# Altium schematic sheet MAGI'sUSBMeter.SchDoc
size A4
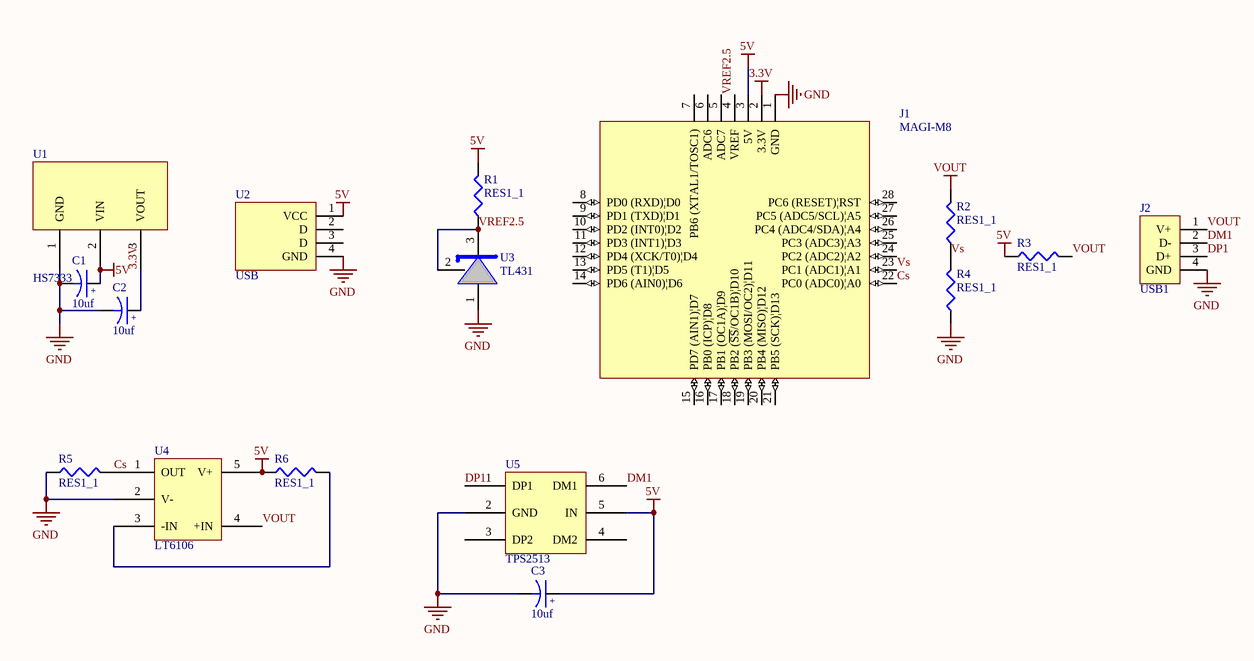
[diagram p0: MAGI'sUSBMeter.SchDoc]

## Parts
C1  10uf  [6-0805_N]
C2  10uf  [6-0805_N]
C3  10uf  [6-0805_N]
J1  MAGI-M8  [MAGI-M8]
J2  USB1  [USB-04A]
R1  RES1_1  [6-0805_N]
R2  RES1_1  [6-0805_N]
R3  RES1_1  [2512]
R4  RES1_1  [6-0805_N]
R5  RES1_1  [6-0805_N]
R6  RES1_1  [6-0805_N]
U1  HS7333  [HS7333]
U2  USB  [MicroUSB]
U3  TL431  [SOT23_N]
U4  LT6106  [LM2731]
U5  TPS2513  [TPS2513]

## Nets
3.3V: C2.1 J1.2(3.3V) U1.3(VOUT)
5V: C1.1 C3.1 J1.3(5V) R1.2 R3.1 R6.1 U1.2(VIN) U2.1(VCC) U4.5(V+) U5.5(IN)
GND: C1.2 C2.2 C3.2 J1.1(GND) J2.4(GND) R4.1 R5.1 U1.1(GND) U2.4(GND) U3.1(CATHODE) U4.2(V-) U5.2(GND)
VOUT: J2.1(V+) R2.2 R3.2 U4.4(+IN)
Cs: J1.22(PC0_(ADC0)|A0) R5.2 U4.1(OUT)
DM1: J2.2(D-) U5.6(DM1)
DP1: J2.3(D+) U5.1(DP1)
VREF2.5: J1.4(VREF) R1.1 U3.2(REF) U3.3(ANODE)
Vs: J1.23(PC1_(ADC1)|A1) R2.1 R4.2
NetR6_2: R6.2 U4.3(-IN)

Not connected (* = marked no-connect by the designer): J1 5(ADC7) 6(ADC6) 7(PB6_(XTAL1/TOSC1)) 8(PD0_(RXD)|D0) 9(PD1_(TXD)|D1) 10(PD2_(INT0)|D2) 11(PD3_(INT1)|D3) 12(PD4_(XCK/T0)|D4) 13(PD5_(T1)|D5) 14(PD6_(AIN0)|D6) 15(PD7_(AIN1)|D7) 16(PB0_(ICP)|D8) 17(PB1_(OC1A)|D9) 18(PB2_(~{SS}/OC1B)|D10) 19(PB3_(MOSI/OC2)|D11) 20(PB4_(MISO)|D12) 21(PB5_(SCK)|D13) 24(PC2_(ADC2)|A2) 25(PC3_(ADC3)|A3) 26(PC4_(ADC4/SDA)|A4) 27(PC5_(ADC5/SCL)|A5) 28(PC6_(RESET)|RST); U2 2(D) 3(D); U5 3(DP2) 4(DM2)

## Notes on the sheet
- (in symbol CAPACITOR POL) +

## Library data of the parts
C1-C3 = CAPACITOR POL: Capacitor